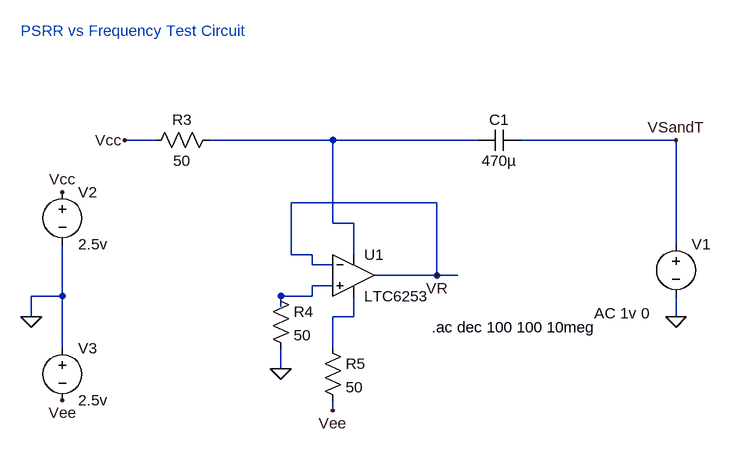
[diagram p0: schematic PSRR.asc]
PSRR.asc, the LTspice schematic file:
Version 4
SHEET 1 880 680
WIRE -336 -224 -384 -224
WIRE -64 -224 -256 -224
WIRE 160 -224 -64 -224
WIRE 464 -224 224 -224
WIRE 96 -128 -128 -128
WIRE -64 -96 -64 -224
WIRE -32 -96 -64 -96
WIRE 464 -64 464 -224
WIRE -128 -48 -128 -128
WIRE -96 -48 -128 -48
WIRE -32 -48 -32 -96
WIRE -96 -32 -96 -48
WIRE -64 -32 -96 -32
WIRE 96 -16 96 -128
WIRE 96 -16 0 -16
WIRE 128 -16 96 -16
WIRE -64 0 -96 0
WIRE -480 16 -480 -64
WIRE -480 16 -528 16
WIRE -96 16 -96 0
WIRE -96 16 -144 16
WIRE -144 32 -144 16
WIRE -528 48 -528 16
WIRE -32 48 -32 16
WIRE -32 48 -64 48
WIRE 464 48 464 16
WIRE -480 96 -480 16
WIRE -64 96 -64 48
WIRE -144 128 -144 96
WIRE -64 192 -64 176
FLAG -528 48 0
FLAG -480 -144 Vcc
FLAG -480 176 Vee
FLAG 464 48 0
FLAG -144 128 0
FLAG -384 -224 Vcc
FLAG -64 192 Vee
FLAG 96 -16 VR
FLAG 464 -224 VSandT
SYMBOL voltage 464 -80 R0
WINDOW 3 -136 217 Left 0
WINDOW 123 -126 122 Left 0
WINDOW 39 0 0 Left 0
SYMATTR Value ""
SYMATTR Value2 AC 1v 0
SYMATTR InstName V1
SYMBOL voltage -480 -160 R0
WINDOW 123 0 0 Left 0
WINDOW 39 0 0 Left 0
SYMATTR InstName V2
SYMATTR Value 2.5v
SYMBOL voltage -480 80 R0
WINDOW 123 0 0 Left 0
WINDOW 39 0 0 Left 0
SYMATTR InstName V3
SYMATTR Value 2.5v
SYMBOL res -160 0 R0
SYMATTR InstName R4
SYMATTR Value 50
SYMBOL res -240 -240 R90
WINDOW 0 0 56 VBottom 0
WINDOW 3 32 56 VTop 0
SYMATTR InstName R3
SYMATTR Value 50
SYMBOL cap 224 -240 R90
WINDOW 0 0 32 VBottom 0
WINDOW 3 32 32 VTop 0
SYMATTR InstName C1
SYMATTR Value 470µ
SYMBOL res -80 80 R0
SYMATTR InstName R5
SYMATTR Value 50
SYMBOL Opamps\\LTC6253 -32 -16 R0
SYMATTR InstName U1
TEXT 88 64 Left 0 !.ac dec 100 100 10meg
TEXT -544 -392 Left 0 ;PSRR vs Frequency Test Circuit

The netlist it stands for:
* PSRR.asc
V1 VSandT 0 AC 1v 0
V2 Vcc 0 2.5v
V3 0 Vee 2.5v
R4 N002 0 50
R3 N001 Vcc 50
C1 VSandT N001 470µ
R5 N003 Vee 50
* U1: LTC6253 (symbol Opamps\LTC6253 not available, pins judged from their places): In+=N002 In-=VR V+=N001 V-=N003 OUT=VR
.ac dec 100 100 10meg
* PSRR vs Frequency Test Circuit
.backanno
.end